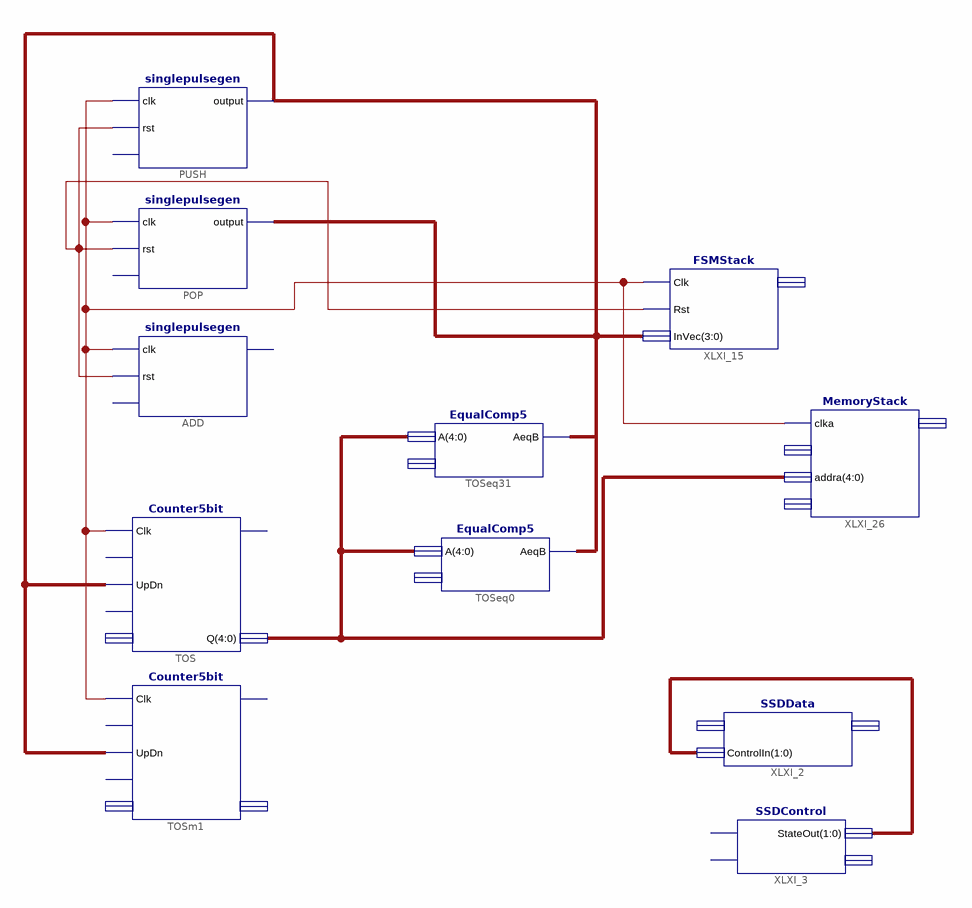
[diagram p0: schematic sheet 1]
// Xilinx ISE schematic sxhma.sch (spartan3e) as structural Verilog: 11 symbols, 0 ports
module sxhma (
);

  wire XLXN_25, XLXN_26;
  wire [1:0] XLXN_2;
  wire [3:0] XLXN_15;
  wire [4:0] XLXN_18;

  singlepulsegen PUSH (.clk(XLXN_25), .rst(XLXN_26), .\output (XLXN_15));  // open: input
  singlepulsegen POP (.clk(XLXN_25), .rst(XLXN_26), .\output (XLXN_15));  // open: input
  singlepulsegen ADD (.clk(XLXN_25), .rst(XLXN_26));  // open: input, output
  FSMStack XLXI_15 (.Clk(XLXN_25), .Rst(XLXN_26), .InVec(XLXN_15));  // open: OutVec
  EqualComp5 TOSeq0 (.A(XLXN_18), .AeqB(XLXN_15));  // open: B
  Counter5bit TOS (.Clk(XLXN_25), .UpDn(XLXN_15), .Q(XLXN_18));  // open: En, LD, InVec, RC
  Counter5bit TOSm1 (.Clk(XLXN_25), .UpDn(XLXN_15));  // open: En, LD, InVec, RC, Q
  EqualComp5 TOSeq31 (.A(XLXN_18), .AeqB(XLXN_15));  // open: B
  MemoryStack XLXI_26 (.clka(XLXN_25), .addra(XLXN_18));  // open: wea, dina, douta
  SSDData XLXI_2 (.ControlIn(XLXN_2));  // open: DataIn, DataOut
  SSDControl XLXI_3 (.StateOut(XLXN_2));  // open: Clk, Rst, ControlOut
endmodule
